# Altium schematic sheet ETHERNET.SchDoc
size A4; SheetNumber: 5; SheetTotal: 8
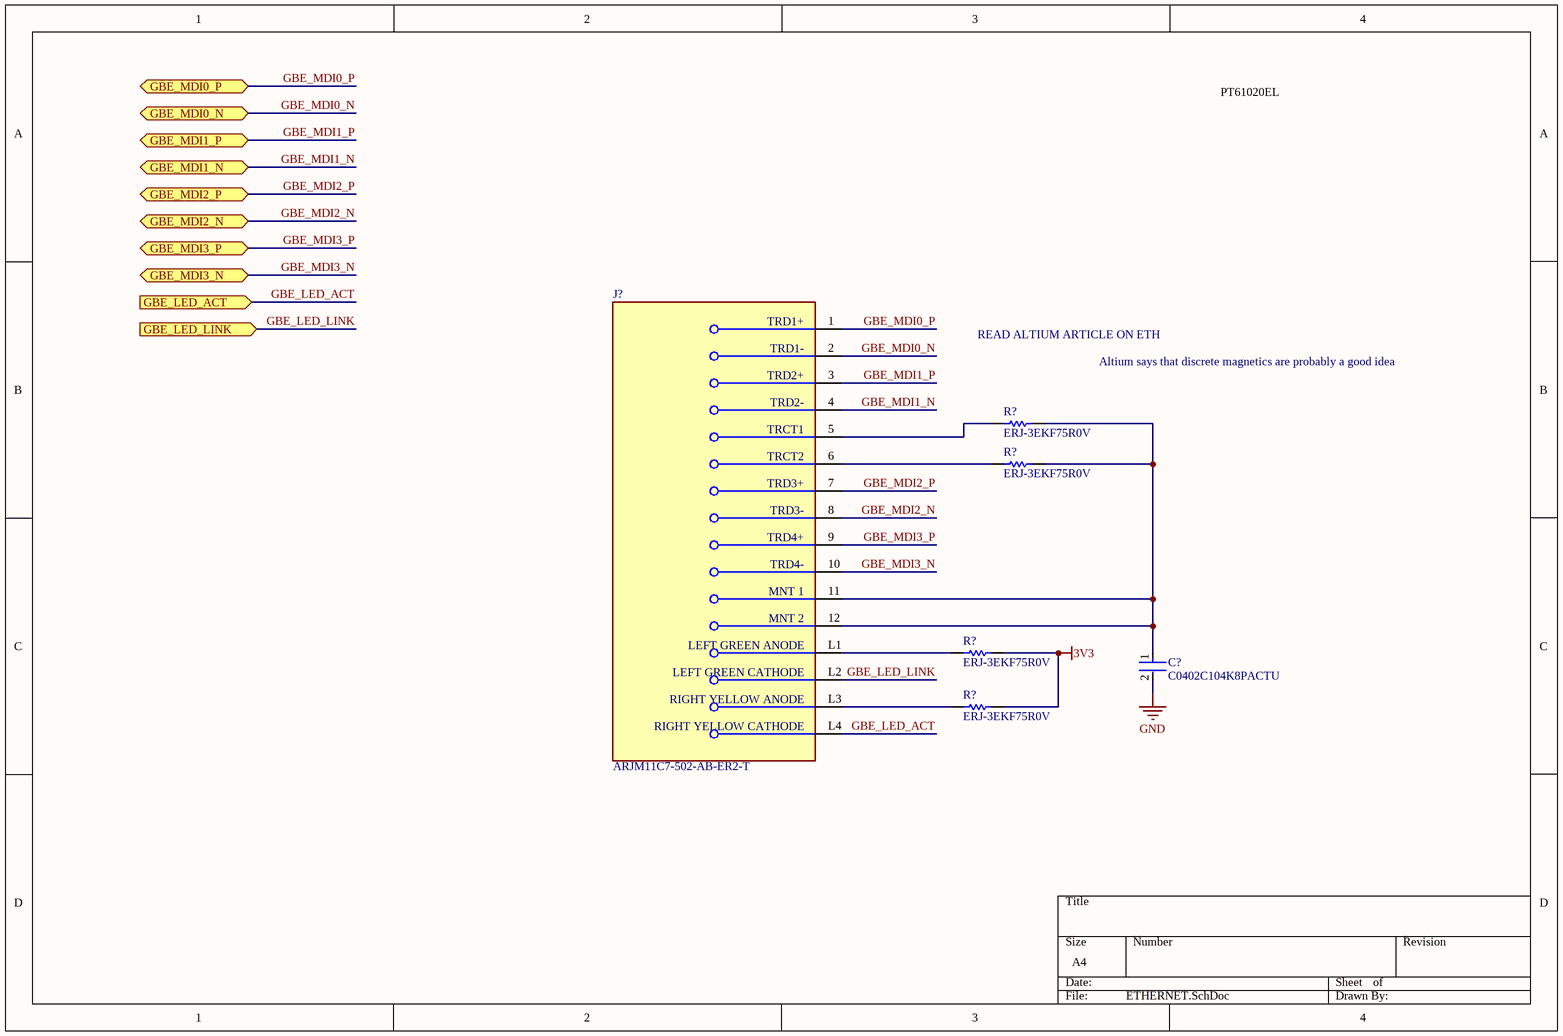
[diagram p0: ETHERNET.SchDoc]

## Parts
(Parts that share a designator on the sheet are numbered #1, #2 ... from top to bottom, then left to right.)
C?  C0402C104K8PACTU  [FP-C0402-BB-MFG]
J?  ARJM11C7-502-AB-ER2-T  [FP-ARJM11C7-502-AB-ER2-T-MFG]
R?#1  ERJ-3EKF75R0V  [RESC1608X55X30LL15T15]
R?#2  ERJ-3EKF75R0V  [RESC1608X55X30LL15T15]
R?#3  ERJ-3EKF75R0V  [RESC1608X55X30LL15T15]
R?#4  ERJ-3EKF75R0V  [RESC1608X55X30LL15T15]

## Ports
GBE_LED_ACT (in), GBE_LED_LINK (in), GBE_MDI0_N (bidir), GBE_MDI0_P (bidir), GBE_MDI1_N (bidir), GBE_MDI1_P (bidir), GBE_MDI2_N (bidir), GBE_MDI2_P (bidir), GBE_MDI3_N (bidir), GBE_MDI3_P (bidir)

## Nets
3V3: R?#3.1 R?#4.1
GND: C?.2
GBE_LED_ACT: J?.L4(RIGHT_YELLOW_CATHODE) ; port GBE_LED_ACT
GBE_LED_LINK: J?.L2(LEFT_GREEN_CATHODE) ; port GBE_LED_LINK
GBE_MDI0_N: J?.2(TRD1-) ; port GBE_MDI0_N
GBE_MDI0_P: J?.1(TRD1+) ; port GBE_MDI0_P
GBE_MDI1_N: J?.4(TRD2-) ; port GBE_MDI1_N
GBE_MDI1_P: J?.3(TRD2+) ; port GBE_MDI1_P
GBE_MDI2_N: J?.8(TRD3-) ; port GBE_MDI2_N
GBE_MDI2_P: J?.7(TRD3+) ; port GBE_MDI2_P
GBE_MDI3_N: J?.10(TRD4-) ; port GBE_MDI3_N
GBE_MDI3_P: J?.9(TRD4+) ; port GBE_MDI3_P
NetC?_1: C?.1 J?.11(MNT_1) J?.12(MNT_2) R?#1.1 R?#2.1
NetJ?_5: J?.5(TRCT1) R?#1.2
NetJ?_6: J?.6(TRCT2) R?#2.2
NetJ?_L1: J?.L1(LEFT_GREEN_ANODE) R?#3.2
NetJ?_L3: J?.L3(RIGHT_YELLOW_ANODE) R?#4.2

## Notes on the sheet
- PT61020EL
- READ ALTIUM ARTICLE ON ETH
- Altium says that discrete magnetics are probably a good idea

## Library data of the parts
C? = CMP-2008-02046-2: CAP CER 0.1UF 10V X5R 0402; Manufacturer: Kemet; Material: Ceramic; Capacitance: 0.10 μF; Temperature Coefficient: 15%; Tolerance: 0.1; Value: 0.10 μF; Package: C0402-BB; Temperature: -55°C to +125°C; ComponentLink2Description: Datasheet; Temperature Characteristic: X5R; Device Class L1: Passive Components; Height: 0.55mm; Lead Free: Yes; ComponentLink2URL: https://content.kemet.com/datasheets/KEM_C1002_X7R_SMD.pdf; Device Class L2: Capacitors; Temperature Range Low: -55°C; Temperature Range High: +125°C; RoHS: TRUE; Octopart: https://octopart.com/c0402c104k8pactu-kemet-140039; Automotive: No; Mouser Description: Capacitor 100 nF 10 VDC 0402; Category: Cap; Voltage Rating: 10 V; Digikey Description: CAP CER 0.1UF 10V X5R 0402; Ipc Land Pattern Name: CAPC10050X50; Device Class L3: Ceramic Capacitors; Manufacturer Part Number: C0402C104K8PACTU
J? = CMP-27893-000001-1: RJ45 JACK W/MAG 1X1 1000BASE-T; Manufacturer: Abracon; Conn Gender: Female; Is Female: yes; Shielding: true; Pitch: 1.27mm; Number Of Contacts: 10; Conn Orientation: Right Angle; RoHS: TRUE; Digikey Description: RJ45 JACK W/MAG 1X1 1000BASE-T; Temperature Range Low: -40°C; ComponentLink2Description: Datasheet; Category: Conn; Temperature Range High: +85°C; Package: 0; Device Class L1: Connectors; Manufacturer Part Number: ARJM11C7-502-AB-ER2-T; ComponentLink2URL: https://abracon.com/Magnetics/ARJM11.pdf; Automotive: No; Contact Material: Gold; Height: 15.8mm; Lead Free: Yes; Temperature: -40°C to +85°C; Device Class L2: Modular / Ethernet Connectors; Device Class L3: unset; Octopart: https://octopart.com/arjm11c7-502-ab-er2-t-abracon-86945316
R?#1-R?#4 = CMP-2000-00639-1: Manufacturer: Panasonic; Part Number: ERJ-3EKF75R0V